# Altium schematic sheet HIVE_BOARD_MISC.SchDoc
size Tabloid; SheetNumber: 12; SheetTotal: 12; Sheet_Name: MISC; Size: 11x17
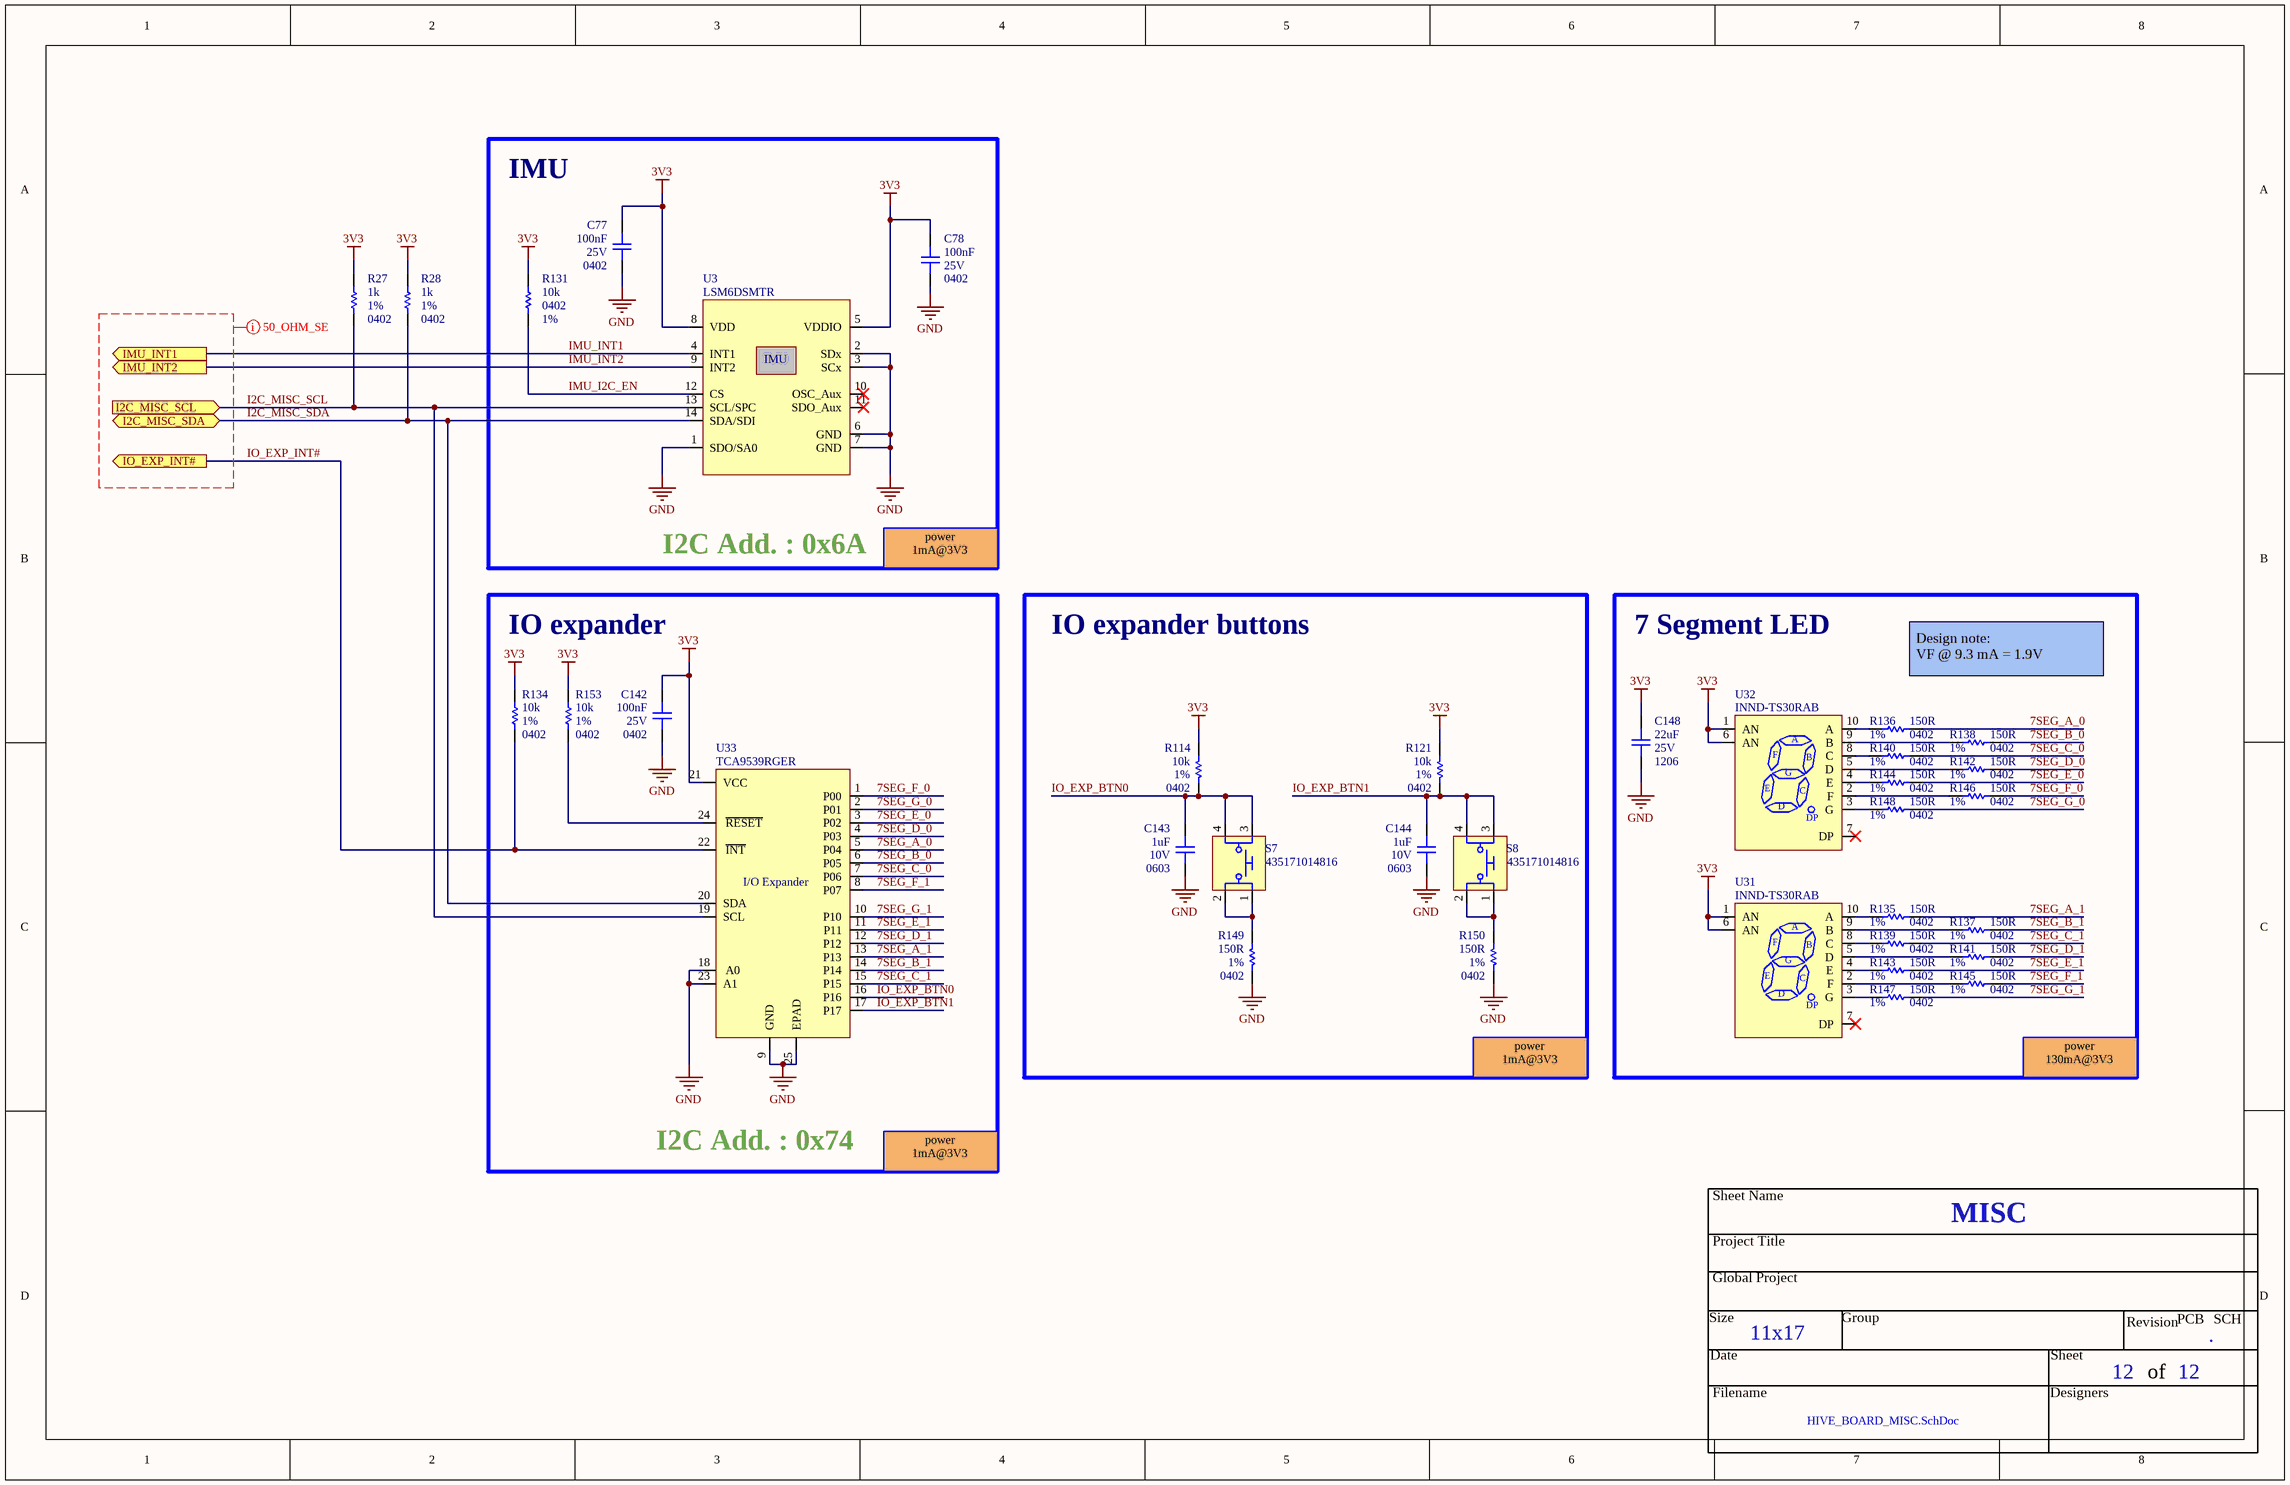
[diagram p0: HIVE_BOARD_MISC.SchDoc]

## Parts
C77  value 100nF  Package: 0402  Voltage Rating: 25V  [CAP_CER_0402]  (hidden comment: CGA2B3X7R1E104K050BB)
C78  value 100nF  Package: 0402  Voltage Rating: 25V  [CAP_CER_0402]  (hidden comment: CGA2B3X7R1E104K050BB)
C142  value 100nF  Package: 0402  Voltage Rating: 25V  [CAP_CER_0402]  (hidden comment: CGA2B3X7R1E104K050BB)
C143  value 1uF  Package: 0603  Voltage Rating: 10V  [CAP_CER_0603]  (hidden comment: C0603C105K8PACTU)
C144  value 1uF  Package: 0603  Voltage Rating: 10V  [CAP_CER_0603]  (hidden comment: C0603C105K8PACTU)
C148  value 22uF  Package: 1206  Voltage Rating: 25V  [CAP_CER_1206]  (hidden comment: CL31A226KAHNNNE)
R27  value 1k  Tolerance: 1%  Package: 0402  [RES_0402]  (hidden comment: RC0402FR-071KL)
R28  value 1k  Tolerance: 1%  Package: 0402  [RES_0402]  (hidden comment: RC0402FR-071KL)
R114  value 10k  Tolerance: 1%  Package: 0402  [RES_0402]  (hidden comment: RC0402FR-0710KL)
R121  value 10k  Tolerance: 1%  Package: 0402  [RES_0402]  (hidden comment: RC0402FR-0710KL)
R131  value 10k  Tolerance: 1%  Package: 0402  [RES_0402]  (hidden comment: RC0402FR-0710KL)
R134  value 10k  Tolerance: 1%  Package: 0402  [RES_0402]  (hidden comment: RC0402FR-0710KL)
R135  value 150R  Tolerance: 1%  Package: 0402  [RES_0402]  (hidden comment: RC0402FR-07150RL)
R136  value 150R  Tolerance: 1%  Package: 0402  [RES_0402]  (hidden comment: RC0402FR-07150RL)
R137  value 150R  Tolerance: 1%  Package: 0402  [RES_0402]  (hidden comment: RC0402FR-07150RL)
R138  value 150R  Tolerance: 1%  Package: 0402  [RES_0402]  (hidden comment: RC0402FR-07150RL)
R139  value 150R  Tolerance: 1%  Package: 0402  [RES_0402]  (hidden comment: RC0402FR-07150RL)
R140  value 150R  Tolerance: 1%  Package: 0402  [RES_0402]  (hidden comment: RC0402FR-07150RL)
R141  value 150R  Tolerance: 1%  Package: 0402  [RES_0402]  (hidden comment: RC0402FR-07150RL)
R142  value 150R  Tolerance: 1%  Package: 0402  [RES_0402]  (hidden comment: RC0402FR-07150RL)
R143  value 150R  Tolerance: 1%  Package: 0402  [RES_0402]  (hidden comment: RC0402FR-07150RL)
R144  value 150R  Tolerance: 1%  Package: 0402  [RES_0402]  (hidden comment: RC0402FR-07150RL)
R145  value 150R  Tolerance: 1%  Package: 0402  [RES_0402]  (hidden comment: RC0402FR-07150RL)
R146  value 150R  Tolerance: 1%  Package: 0402  [RES_0402]  (hidden comment: RC0402FR-07150RL)
R147  value 150R  Tolerance: 1%  Package: 0402  [RES_0402]  (hidden comment: RC0402FR-07150RL)
R148  value 150R  Tolerance: 1%  Package: 0402  [RES_0402]  (hidden comment: RC0402FR-07150RL)
R149  value 150R  Tolerance: 1%  Package: 0402  [RES_0402]  (hidden comment: RC0402FR-07150RL)
R150  value 150R  Tolerance: 1%  Package: 0402  [RES_0402]  (hidden comment: RC0402FR-07150RL)
R153  value 10k  Tolerance: 1%  Package: 0402  [RES_0402]  (hidden comment: RC0402FR-0710KL)
S7  435171014816  [SWI_TACT_435171014816]
S8  435171014816  [SWI_TACT_435171014816]
U3  LSM6DSMTR  [SEN_IMU_LSM6DSMTR]
U31  INND-TS30RAB  [LED_7SEG_INND-TS30RAB]
U32  INND-TS30RAB  [LED_7SEG_INND-TS30RAB]
U33  TCA9539RGER  [LOG_IOEXP_TCA9539RGER]

## Blocks framed on the sheet
IO expander buttons: C143 C144 R114 R121 R149 R150 S7 S8
7 Segment LED: C148 R135-R148 U31 U32

## Ports
I2C_MISC_SCL (in), I2C_MISC_SDA (bidir), IMU_INT1 (out), IMU_INT2 (out), IO_EXP_INT# (out)

## Nets
3V3: C77.1 C78.1 C142.1 C148.2 R27.1 R28.1 R114.2 R121.2 R131.1 R134.2 R153.2 U3.5(VDDIO) U3.8(VDD) U31.1(AN) U31.6(AN) U32.1(AN) U32.6(AN) U33.21(VCC)
GND: C77.2 C78.2 C142.2 C143.2 C144.2 C148.1 R149.1 R150.1 U3.1(SDO/SA0) U3.2(SDx) U3.3(SCx) U3.6(GND) U3.7(GND) U33.9(GND) U33.18(A0) U33.23(A1) U33.25(EPAD)
7SEG_A_0: R136.1 U33.5(P04)
7SEG_A_1: R135.1 U33.13(P13)
7SEG_B_0: R138.1 U33.6(P05)
7SEG_B_1: R137.1 U33.14(P14)
7SEG_C_0: R140.1 U33.7(P06)
7SEG_C_1: R139.1 U33.15(P15)
7SEG_D_0: R142.1 U33.4(P03)
7SEG_D_1: R141.1 U33.12(P12)
7SEG_E_0: R144.1 U33.3(P02)
7SEG_E_1: R143.1 U33.11(P11)
7SEG_F_0: R146.1 U33.1(P00)
7SEG_F_1: R145.1 U33.8(P07)
7SEG_G_0: R148.1 U33.2(P01)
7SEG_G_1: R147.1 U33.10(P10)
I2C_MISC_SCL: R27.2 U3.13(SCL/SPC) U33.19(SCL) ; port I2C_MISC_SCL
I2C_MISC_SDA: R28.2 U3.14(SDA/SDI) U33.20(SDA) ; port I2C_MISC_SDA
IMU_I2C_EN: R131.2 U3.12(CS)
IMU_INT1: U3.4(INT1) ; port IMU_INT1
IMU_INT2: U3.9(INT2) ; port IMU_INT2
IO_EXP_BTN0: C143.1 R114.1 S7.3 S7.4 U33.16(P16)
IO_EXP_BTN1: C144.1 R121.1 S8.3 S8.4 U33.17(P17)
IO_EXP_INT#: R134.1 U33.22(~{INT}) ; port IO_EXP_INT#
NetR135_2: R135.2 U31.10(A)
NetR136_2: R136.2 U32.10(A)
NetR137_2: R137.2 U31.9(B)
NetR138_2: R138.2 U32.9(B)
NetR139_2: R139.2 U31.8(C)
NetR140_2: R140.2 U32.8(C)
NetR141_2: R141.2 U31.5(D)
NetR142_2: R142.2 U32.5(D)
NetR143_2: R143.2 U31.4(E)
NetR144_2: R144.2 U32.4(E)
NetR145_2: R145.2 U31.2(F)
NetR146_2: R146.2 U32.2(F)
NetR147_2: R147.2 U31.3(G)
NetR148_2: R148.2 U32.3(G)
NetR149_2: R149.2 S7.1 S7.2
NetR150_2: R150.2 S8.1 S8.2
NetR153_1: R153.1 U33.24(~{RESET})

Not connected (* = marked no-connect by the designer): U3 10(OSC_Aux)* 11(SDO_Aux)*; U31 7(DP)*; U32 7(DP)*

## Layout directives
net class SE_50: (no net found under the mark)

## Notes on the sheet
- IMU
- I2C Add. : 0x6A
- power
  1mA@3V3
- IO expander
- Design note:
  VF @ 9.3 mA = 1.9V
- power
  130mA@3V3
- I2C Add. : 0x74
- Sheet Name
- Project Title
- Global Project
- Size
- Date
- Group
- Sheet
- Revision
- of
- PCB
- .
- SCH
- Filename
- Designers
- (in symbol LOG_IOEXP_TCA9539RGER) I/O Expander
- (in symbol SEN_IMU_LSM6DSMTR) IMU

## Library data of the parts
C77 C78 C142 = CAP_CER_CGA2B3X7R1E104K050BB: CAP - CER 0.1µF 10% 25V X7R - 0402; Manufacturer #1: TDK Corporation; GRAMS Lib Spec: 2.8; Magnetic Material: Unknown; Polarized: NO; Assembly Type: SMD; CreatedBy/Date: Nicolas Roy 2018-11-07; Current Rating: *; HelpURL: https://product.tdk.com/info/en/catalog/datasheets/mlcc_automotive_general_en.pdf; Manufacturer #2: *; Note: *; Part Number #1: CGA2B3X7R1E104K050BB; Part Number #2: *; Power Max: *; Temperature: -55°C ~ 125°C; Tolerance: 10%; VerifiedBy: Nicolas V. (2019-01-22); Supplier 1: Digi-Key; Supplier Part Number 1: 445-6902-1-ND; Cryo: UNKNOWN
C143 C144 = CAP_CER_C0603C105K8PACTU: CAP - CER 1uF 10V 10% X5R - 0603; Manufacturer #1: KEMET; GRAMS Lib Spec: 2.8; Magnetic Material: Unknown; Polarized: NO; Tolerance: 10%; Current Rating: *; Power Max: *; HelpURL: https://content.kemet.com/datasheets/KEM_C1006_X5R_SMD.pdf; CreatedBy/Date: Hubert Dube - 21/07/20; VerifiedBy: Louis-Daniel Gaulin - 21/07/20; Temperature: -55°C ~ 85°C; Manufacturer #2: *; Assembly Type: SMD; Part Number #2: *; Part Number #1: C0603C105K8PACTU; Cryo: UNKNOWN; Supplier 1: Digi-Key; Supplier Part Number 1: 399-3118-1-ND
C148 = CAP_CER_CL31A226KAHNNNE: CAP - CER 22uF 10% 25V X5R - 1206; Manufacturer #1: Samsung Electro-Mechanics; GRAMS Lib Spec: 2.8; Magnetic Material: Unknown; Polarized: NO; Assembly Type: SMD; CreatedBy/Date: Philippe Arsenault/21 Janvier 2020; Current Rating: *; HelpURL: http://www.samsungsem.com/global/support/product-search/mlcc/1207445_4880.html; Manufacturer #2: *; Note: *; Part Number #1: CL31A226KAHNNNE; Part Number #2: 1276-3047-1-ND; Power Max: *; Temperature: -55°C ~ 85°C; Tolerance: 10%; VerifiedBy: C.Paulin - 28/01/2020; Supplier 1: Digi-Key; Supplier Part Number 1: 1276-3047-1-ND; Cryo: UNKNOWN
R27 R28 = RES_RC0402FR-071KL: RES - 1K OHM 1% 1/16W - 0402; Manufacturer #1: Yageo; GRAMS Lib Spec: 2.8; Magnetic Material: YES; Polarized: NO; Voltage Rating: 50V; Cryo: UNKNOWN; Assembly Type: SMD; CreatedBy/Date: Jonathan Bouchard 2018-07-05; Current Rating: *; HelpURL: http://www.yageo.com/documents/recent/PYu-RC_Group_51_RoHS_L_9.pdf; Manufacturer #2: *; Note: *; Part Number #1: RC0402FR-071KL; Part Number #2: *; Power Max: 1/16W; Temperature: -55°C ~ 155°C; VerifiedBy: Arnaud Samson 16-07-18; Supplier 1: Digi-Key; Supplier Part Number 1: 311-1.00KLRCT-ND
R114 R121 R131 R134 R153 = RES_RC0402FR-0710KL: RES - 10K OHMS 1% 1/16W - 0402; Manufacturer #1: Yageo; GRAMS Lib Spec: 2.8; Magnetic Material: UNKNOWN; Polarized: NO; Voltage Rating: 50V; Assembly Type: SMD; CreatedBy/Date: Nicolas V. (2018-11-20); Current Rating: *; HelpURL: http://www.yageo.com/documents/recent/PYu-RC_Group_51_RoHS_L_9.pdf; Manufacturer #2: *; Note: *; Part Number #1: RC0402FR-0710KL; Part Number #2: *; Power Max: 1/16W; Temperature: -55°C ~ 155°C; VerifiedBy: Nicolas V. (2018-11-20); Supplier 1: Digi-Key; Supplier Part Number 1: 311-10.0KLRCT-ND; Cryo: UNKNOWN
  R131: Solder Paste Type: UNKNOWN; Stencil Thickness (Recommended): UNKNOWN
R135-R150 = RES_RC0402FR-07150RL: RES - 150R 1% 1/16W - 0402; Manufacturer #1: Yageo; GRAMS Lib Spec: 2.8; Magnetic Material: Unknown; Polarized: No; Voltage Rating: 50V; Assembly Type: SMD; CreatedBy/Date: Jonathan Bouchard 2019-03-25; Current Rating: *; HelpURL: http://www.yageo.com/documents/recent/PYu-RC_Group_51_RoHS_L_10.pdf; Manufacturer #2: *; Part Number #1: RC0402FR-07150RL; Part Number #2: *; Power Max: 1/16W; Temperature: -55°C ~ 155°C; VerifiedBy: Nicolas V. (2019-05-02); Supplier 1: Digi-Key; Supplier Part Number 1: 311-150LRCT-ND; Cryo: UNKNOWN
S7 S8 = SWI_TACT_435171014816: SWI - SWITCH TACTILE SPST-NO 0.05A 12V -SMD; Manufacturer #1: Würth Elektronik; Current Rating: 50mA; Voltage rating: 12VDC; Polarized: No; Magnetic Material: UNKNOWN; GRAMS Lib Spec: 2.8; Manufacturer #2: *; Power Max: *; Value: SPST-NO; Part Number #1: 435171014816; Part Number #2: *; HelpURL: https://www.we-online.com/catalog/datasheet/435171014816.pdf; Supplier 1: Digi-Key; Supplier Part Number 1: 732-435171014816CT-ND; Assembly Type: SMD; Temperature: -40°C ~ 85°C; Package: SMD; CreatedBy/Date: Hubert Dube - 22/07/20; Tolerance: *; VerifiedBy: Louis-Daniel Gaulin / 12-11-2020; Cryo: UNKNOWN
U3 = SEN_IMU_LSM6DSMTR: SEN_IMU -  ACCEL/GYRO 6 Axis I2C/SPI - 14-VFLGA; Manufacturer #1: STMicroelectronics; Voltage Rating: 1.71V ~ 3.6V; Current Rating: 0.65mA; Power Max: 3mW; GRAMS Lib Spec: 2.7c; Magnetic Material: Unknown; Polarized: YES; Value: -; Tolerance: -; HelpURL: https://www.st.com/content/ccc/resource/technical/document/datasheet/76/27/cf/88/c5/03/42/6b/DM00218116.pdf/files/DM00218116.pdf/jcr:content/translations/en.DM00218116.pdf; CreatedBy/Date: Louis-Daniel Gaulin / 06-10-2020; VerifiedBy: Philippe Arsenault/2020-11-06; Temperature: -40°C ~ 85°C (TA); Package: 14-VFLGA; Manufacturer #2: -; Note: -; Assembly Type: SMD; Part Number #2: -; Part Number #1: LSM6DSMTR; Supplier 1: Digi-Key; Supplier Part Number 1: 497-16696-1-ND
U31 U32 = LED_7SEG_INND-TS30RAB: LED_7SEG  - LED Character and Numeric Red 7-Segment 1 Character Common Anode 2V - 10-TH; Current Rating: 20mA; Note: Operate at 10mA; Voltage rating: 2V (Vf); Polarized: Yes; Magnetic Material: Unknown; GRAMS Lib Spec: 2.8; Manufacturer #1: INND-TS30RAB; Manufacturer #2: *; Power Max: *; Part Number #2: *; HelpURL: http://www.inolux-corp.com/datasheet/Display/Through-Hole-Display/SingleDigit/INND-TS30%20Series_V1.0.pdf; Part Number #1: INND-TS30RAB; Supplier 1: Digi-Key; Supplier Part Number 1: 1830-1146-ND; Value: *; Assembly Type: TH; Temperature: -35°C ~ 85°C; Package: 10-TH; CreatedBy/Date: Louis-Daniel Gaulin / 10-05-2021; VerifiedBy: Philippe Arsenault/10-05-2021; Cryo: UNKNOWN
U33 = LOG_IOEXP_TCA9539RGER: LOG - 16-Bit I2C/SMBus, I/O Expander - 24-VQFN-EP; Manufacturer #1: Texas Instruments; Voltage rating: 1.65V ~ 5.5V; Polarized: Yes; Magnetic Material: Unknown; GRAMS Lib Spec: 2.8; Current Rating: *; Manufacturer #2: *; Power Max: *; Part Number #2: *; HelpURL: https://www.ti.com/lit/ds/symlink/tca9539.pdf?HQS=dis-dk-null-digikeymode-dsf-pf-null-wwe&ts=1620652560420; Part Number #1: TCA9539RGER; Supplier 1: Digi-Key; Supplier Part Number 1: 296-44209-1-ND; Value: *; Assembly Type: SMD; Temperature: -40°C ~ 85°C; Package: 24-VQFN-EP; CreatedBy/Date: Louis-Daniel Gaulin / 10-05-2021; VerifiedBy: Philippe Arsenault/2021-05-10; Cryo: UNKNOWN